# EAGLE design central_sensores (EAGLE 9.2.2)
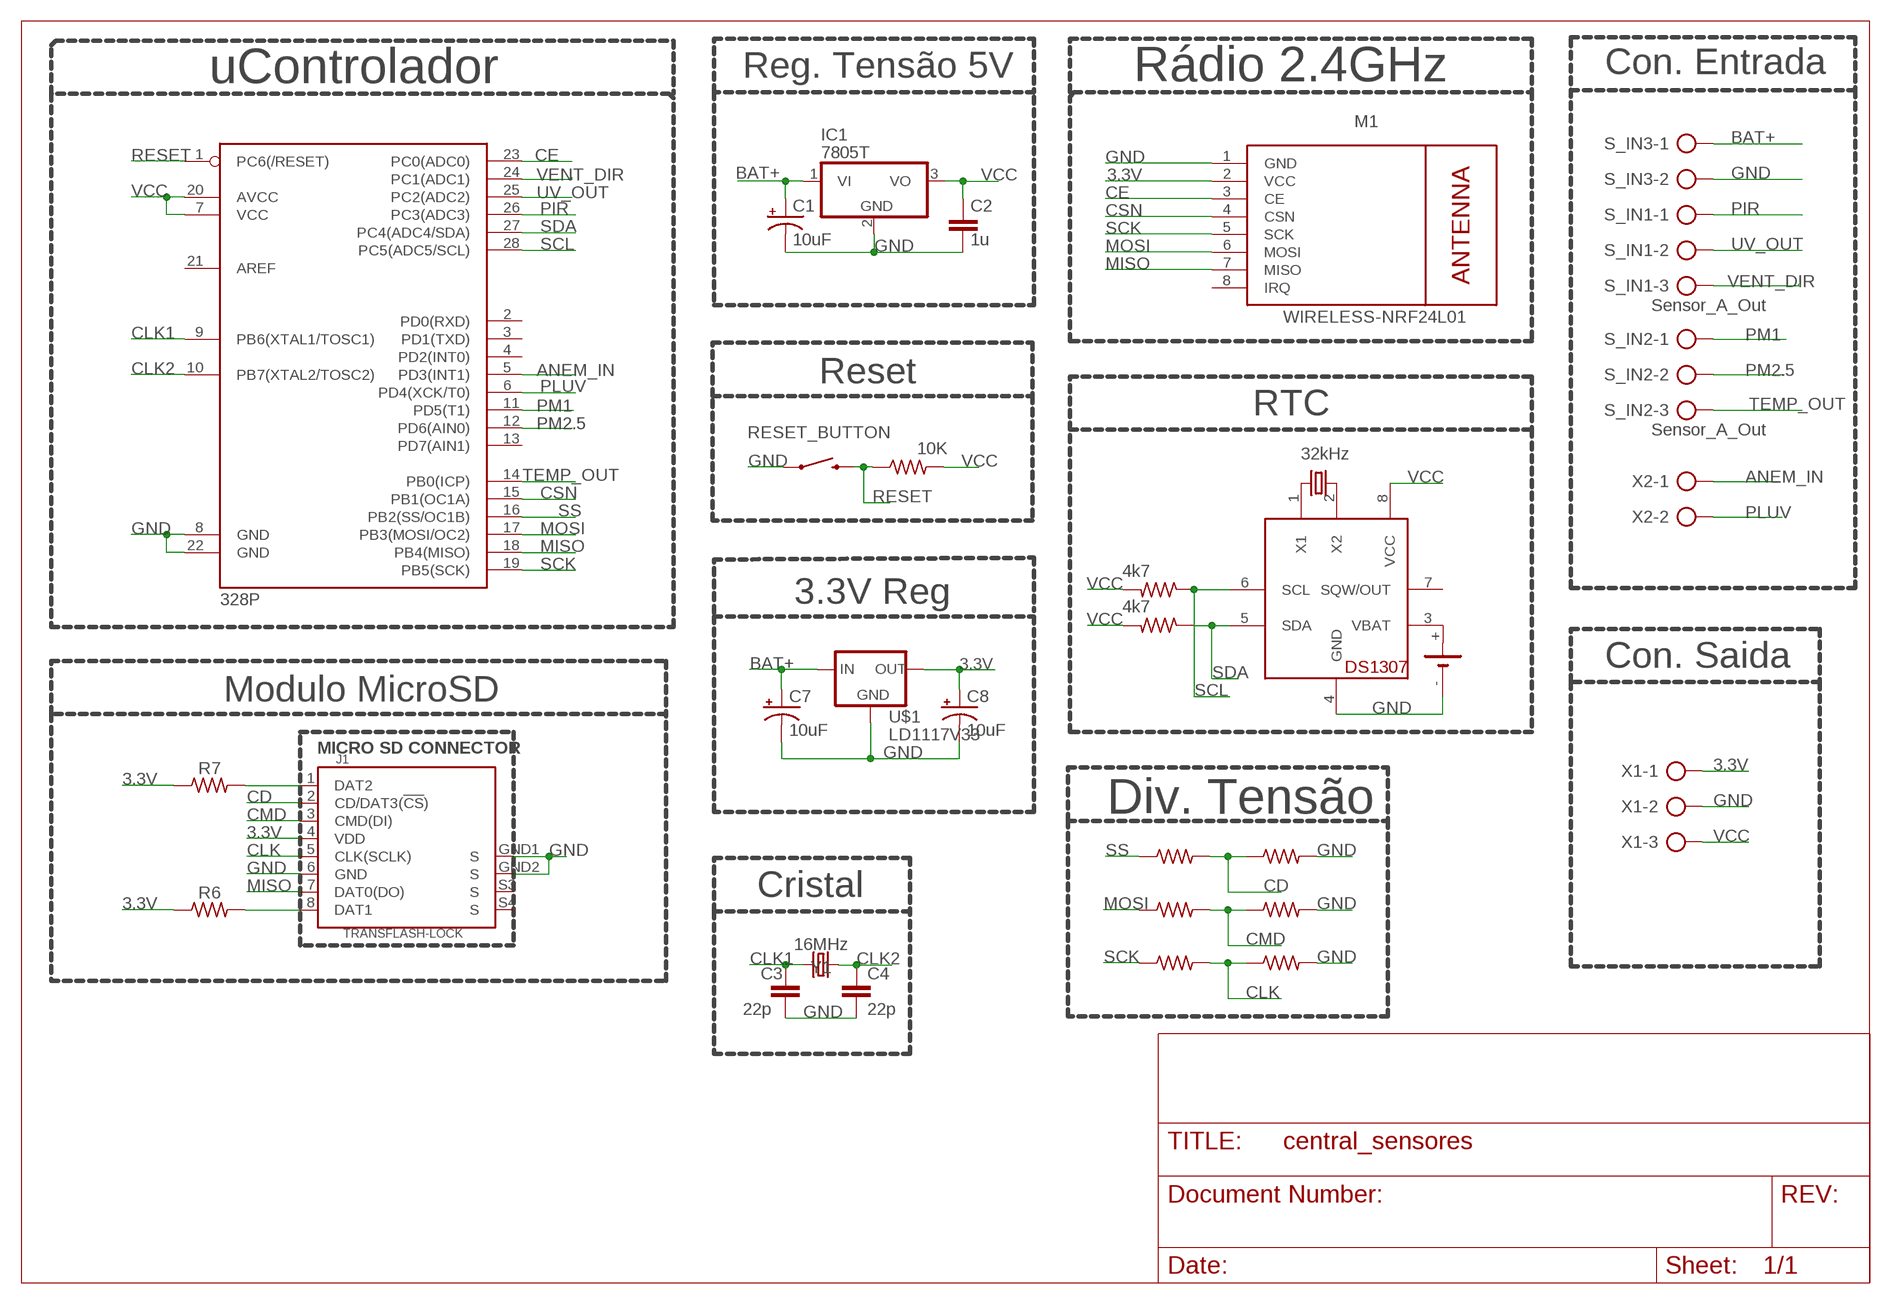
[diagram p0: schematic, sheet 1]

## Parts
C1  10uF  10UF-POLAR-RADIAL-2.5MM-25V-20%  [CPOL-RADIAL-2.5MM-5MM]
C2  1u  C-EU025-024X044  [C025-024X044]
C3  22p  C2,5-3  [C2.5-3]
C4  22p  C2,5-3  [C2.5-3]
C7  10uF  10UF-POLAR-RADIAL-2.5MM-25V-20%  [CPOL-RADIAL-2.5MM-5MM]
C8  10uF  10UF-POLAR-RADIAL-2.5MM-25V-20%  [CPOL-RADIAL-2.5MM-5MM]
G2  CH291-1220LF  [CH291-1220LF]
IC1  7805T  [TO220H]
IC2  DS1307  [DIL08]
J1  TRANSFLASH-LOCK  [TRANSFLASH-LOCK-SOCK]
M1  WIRELESS-NRF24L01  [WIRELESS-NRF24L01]
R1  10K  R-US_0204/7  [0204/7]
R2  R-US_0204/7  [0204/7]
R3  R-US_0204/7  [0204/7]
R4  4k7  R-US_0204/7  [0204/7]
R5  4k7  R-US_0204/7  [0204/7]
R6  100k  R-US_0204/7  [0204/7]
R7  100k  R-US_0204/7  [0204/7]
R8  R-US_0204/7  [0204/7]
R9  R-US_0204/7  [0204/7]
R10  R-US_0204/7  [0204/7]
R11  R-US_0204/7  [0204/7]
RESET_BUTTON  MOMENTARY-SWITCH-SPST-PTH-6.0MM  [TACTILE_SWITCH_PTH_6.0MM]
S_IN1  Sensor_A_Out  AK500/3-H  [AK500/3-H]
S_IN2  Sensor_A_Out  AK500/3-H  [AK500/3-H]
S_IN3  Sensor_A_Out  AK500/2-H  [AK500/2-H]
U1  328P  ATMEGA328P_PDIP  [DIP28]
U$1  LD1117V33  [LD1117V33]
X1  AK500/3-H  [AK500/3-H]
X2  AK500/2-H  [AK500/2-H]
Y1  16MHz  CRYSTAL-16MHZPTH-HC49US  [HC49US]
Y2  32kHz  CRYSTALTC38H  [TC38H]

## Nets
3.3V: C8.1(+) J1.4(VDD) M1.2(VCC) R6.1 R7.1 U$1.OUT X1.1
ANEM_IN: U1.5(PD3(INT1)) X2.1
BAT+: C1.1(+) C7.1(+) IC1.1(VI) S_IN3.1 U$1.IN
CD: J1.2(CD/DAT3(!CS!)) R2.2 R3.1
CE: M1.3(CE) U1.23(PC0(ADC0))
CLK: J1.5(CLK(SCLK)) R10.2 R11.1
CLK1: C3.1 U1.9(PB6(XTAL1/TOSC1)) Y1.2
CLK2: C4.1 U1.10(PB7(XTAL2/TOSC2)) Y1.1
CMD: J1.3(CMD(DI)) R8.2 R9.1
CSN: M1.4(CSN) U1.15(PB1(OC1A))
GND: C1.2(-) C2.2 C3.2 C4.2 C7.2(-) C8.2(-) G2.- IC1.2(GND) IC2.4(GND) J1.6(GND) J1.GND1(S) J1.GND2(S) M1.1(GND) R3.2 R9.2 R11.2 RESET_BUTTON.1 S_IN3.2 U1.8(GND) U1.22(GND) U$1.GND X1.2
MISO: J1.7(DAT0(DO)) M1.7(MISO) U1.18(PB4(MISO))
MOSI: M1.6(MOSI) R8.1 U1.17(PB3(MOSI/OC2))
N$1: IC2.2(X2) Y2.2
N$2: IC2.1(X1) Y2.1
N$3: G2.+ IC2.3(VBAT)
N$4: J1.8(DAT1) R6.2
N$11: J1.1(DAT2) R7.2
PIR: S_IN1.1 U1.26(PC3(ADC3))
PLUV: U1.6(PD4(XCK/T0)) X2.2
PM1: S_IN2.1 U1.11(PD5(T1))
PM2.5: S_IN2.2 U1.12(PD6(AIN0))
RESET: R1.1 RESET_BUTTON.3 U1.1(PC6(/RESET))
SCK: M1.5(SCK) R10.1 U1.19(PB5(SCK))
SCL: IC2.6(SCL) R4.1 U1.28(PC5(ADC5/SCL))
SDA: IC2.5(SDA) R5.1 U1.27(PC4(ADC4/SDA))
SS: R2.1 U1.16(PB2(SS/OC1B))
TEMP_OUT: S_IN2.3 U1.14(PB0(ICP))
UV_OUT: S_IN1.2 U1.25(PC2(ADC2))
VCC: C2.1 IC1.3(VO) IC2.8(VCC) R1.2 R4.2 R5.2 U1.7(VCC) U1.20(AVCC) X1.3
VENT_DIR: S_IN1.3 U1.24(PC1(ADC1))
Unconnected: IC2.7(SQW/OUT) J1.S3(S) J1.S4(S) M1.8(IRQ) U1.2(PD0(RXD)) U1.3(PD1(TXD)) U1.4(PD2(INT0)) U1.13(PD7(AIN1)) U1.21(AREF)

## Notes on the sheet
- uControlador | Reg. Tensão 5V | Rádio 2.4GHz | Con. Entrada
- Reset
- RTC
- 3.3V Reg
- Con. Saida
- Modulo MicroSD
- MICRO SD CONNECTOR
- Div. Tensão
- Cristal

## Library data of the parts
C1 C7 C8 = SparkFun-Capacitors:10UF-POLAR: 10.0µF polarized capacitors A capacitor is a passive two-terminal electrical component used to store electrical energy temporarily in an electric field.; PROD_ID: CAP-08440
C2 = resistor:C-EU: CAPACITOR, European symbol
C3 C4 = capacitor-wima:C: CAPACITOR naming: grid - package width
G2 = battery:CH291-1220LF: Battery Holder, SMT, 12mm multicomp PART NO. CH291-1220LF Source: Data sheet <http://www.farnell.com/datasheets/1505860.pdf>
IC1 = linear:78*: Positive VOLTAGE REGULATOR Source: http://cache.national.com/ds/LM/LM78L05.pdf http://www.fairchildsemi.com/ds/LM/LM7805.pdf
IC2 = adafruit:DS1307: DS1307 Real time clock (RTC) with battery backup ability. Talk to it via i2c
J1 = uSD_socket:TRANSFLASH: TransFlash TF Micro SD Card Socket Adapter
M1 = diy-modules:WIRELESS-NRF24L01: 2.4 GHz Wireless Module based on NRF24L01 chip More details available here: http://www.electrodragon.com/w/NRF24L01 Click here to find device on ebay.com <http://www.ebay.com/sch/nrf24l01+arduino>
R1 R4 R5 = adafruit:R-US_: RESISTOR, American symbol
R2 R3 R6-R11 = resistor:R-US_: RESISTOR, American symbol
RESET_BUTTON = SparkFun-Switches:MOMENTARY-SWITCH-SPST: Momentary Switch (Pushbutton) - SPST Normally-open (NO) SPST momentary switches (buttons, pushbuttons). Variants PTH-12MM - 12mm square, through-hole Momentary Pushbutton Switch - 12mm Square <https://www.sparkfun.com/products/9190> (COM-09190) PTH-6.0MM, PTH-6.0MM-KIT - 6.0mm square, through-hole Mini Pushbutton Switch <https://www.sparkfun.com/products/97> (COM-00097) KIT package intended for soldering kit's - only one side of pads' copper is exposed. PTH-RIGHT-ANGLE-KIT - Right-angle, through-hole Right Angle Tactile Button <https://www.sparkfun.com/products/10791> - Used on SparkFun BigTime Watch Kit <https://www.sparkfun.com/products/11734> SMD-12MM - 12mm square, surface-mount Tactile Button - SMD (12mm) <https://www.sparkfun.com/products/12993> (COM-12993) Used on SparkFun PicoBoard <https://www.sparkfun.com/products/11888> SMD-4.5MM - 4.5mm Square Trackball Switch Used on SparkFun Blackberry Trackballer Breakout <https://www.sparkfun.com/products/13169> SMD-4.6MMX2.8MM - 4.60mm x 2.80mm, surface mount Used on SparkFun SAMD21 Mini Breakout <https://www.sparkfun.com/products/13664> SMD-5.2MM, SMD-5.2-REDUNDANT - 5.2mm square, surface-mount Mini Pushbutton Switch - SMD <https://www.sparkfun.com/products/8720> (COM-08720) Used on Arduino Pro Mini <https://www.sparkfun.com/products/11114> REDUNDANT package connects both switch circuits together SMD-6.0X3.5MM - 6.0 x 3.5mm, surface mount Momentary Reset Switch SMD <https://www.sparkfun.com/products/8229> (COM-08229) SMD-6.2MM-TALL - 6.2mm square, surface mount Tactile Button - SMD (6mm) <https://www.sparkfun.com/products/12992> Used on SparkFun Digital Sandbox <https://www.sparkfun.com/products/12651> SMD-RIGHT-ANGLE - Right-angle, surface mount Used on SparkFun Block for Intel® Edison - Arduino <https://www.sparkfun.com/products/13036>; PROD_ID: SWCH-08441; SF_SKU: COM-00097
S_IN1 S_IN2 X1 = con-ptr500:AK500/3-H: CONNECTOR Aug. 2004 / PTR Meßtechnik: Die Bezeichnung der Serie AK505 wurde geändert. Es handelt sich hierbei um AK500 in horizontaler Ausführung.; OC_FARNELL: unknown; OC_NEWARK: unknown
S_IN3 X2 = con-ptr500:AK500/2-H: CONNECTOR Aug. 2004 / PTR Meßtechnik: Die Bezeichnung der Serie AK505 wurde geändert. Es handelt sich hierbei um AK500 in horizontaler Ausführung.; OC_FARNELL: unknown; OC_NEWARK: unknown
U1 = SparkFun-IC-Microcontroller:ATMEGA328P_PDIP: Atmel 328P Through hole ATMEGA328P uC used in the Arduino 32kb flash, 1k EEPROM, 2k SRAM Datasheet <http://www.sparkfun.com/datasheets/Components/SMD/ATMega328.pdf> SparkFun Products Storefront component: AVR 28 Pin 20MHz 32K 6A/D - ATMega328P <https://www.sparkfun.com/products/9061> (COM-09061) SparkFun Simon Says - Through-Hole Soldering Kit <https://www.sparkfun.com/products/10547> (KIT-10547) SparkFun Learn to Solder - Simon Says <https://www.sparkfun.com/products/13708> (KIT-13708) SparkFun BigTime Watch Kit <https://www.sparkfun.com/products/11734> (KIT-11734) SparkFun ClockIt <https://www.sparkfun.com/products/10930> (KIT-10930) SparkFun Serial Enabled LCD Kit <https://www.sparkfun.com/products/10097> (LCD-10097) SparkFun Simon Tilts - Through Hole Soldering Kit <https://www.sparkfun.com/products/12634> (KIT-12634) SparkFun Frequency Counter Kit <https://www.sparkfun.com/products/10140> (KIT-10140) FabFM Radio Kit <https://www.sparkfun.com/products/11043> (KIT-11043) SparkFun Binary Blaster Kit <https://www.sparkfun.com/products/12037> (KIT-12037) SparkFun Metro-Gnome <https://www.sparkfun.com/products/9236> (KIT-09236) ATmega328 with Arduino Optiboot (Uno) <https://www.sparkfun.com/products/10524> (DEV-10524); PROD_ID: IC-09136
U$1 = LD1117V33:LD1117V33: Quero morrer
Y1 = SparkFun-Clocks:CRYSTAL-16MHZ: 16MHz Crystal Digikey Example <http://www.digikey.com/product-search/en?keywords=535-9122-1-ND> Frequency: 16MHz Frequency Stability: ±50ppm Frequency Tolerance: ±20ppm Load Capacitance: 18pF SparkFun Products: Pro Micro -5V/16MHz <https://www.sparkfun.com/products/12640> SparkFun Serial Enabled LCD Kit <https://www.sparkfun.com/products/10097>; PROD_ID: XTAL-08181; SF_ID: COM-00536
Y2 = SparkFun-FreqCtrl:CRYSTAL: Various standard crystals. Proven footprints.

## Net classes
0 default: width 0.4 mm, drill 0.6 mm, clearance 0.2 mm

## Board
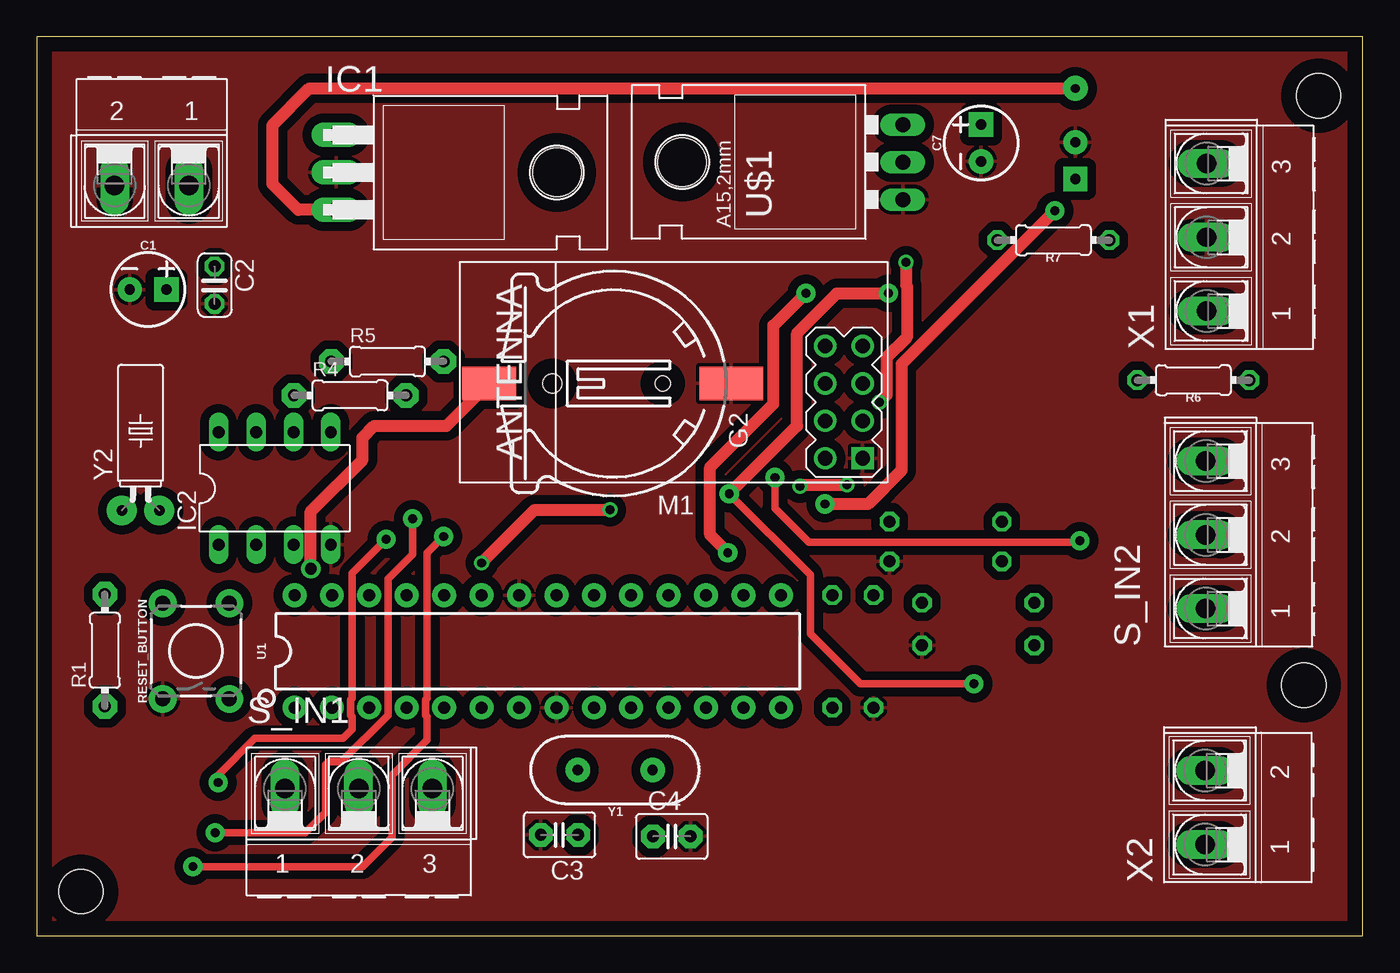
[diagram p1: board, top side]
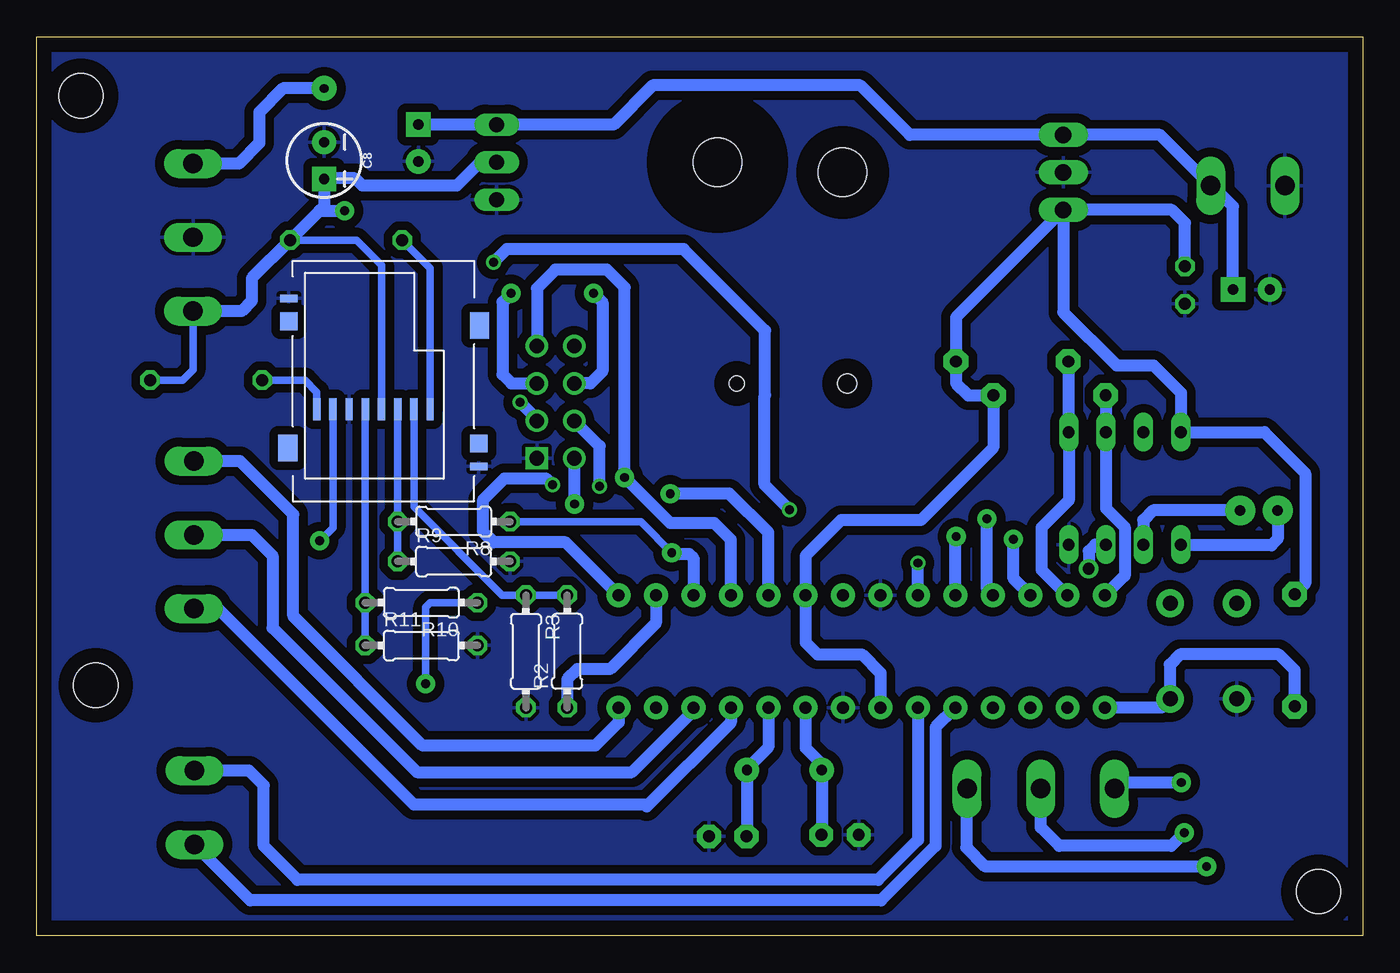
[diagram p2: board, bottom side, seen from below]

Size 90 x 61 mm. Coordinates in mm from the lower left corner, seen from the top.
Outline: 0,0 90,0 90,61 0,61 0,0
Copper layers (1*16): Top 0.035mm / dielectric 1.5mm / Bottom 0.035mm
Design rules "default": minimum track width 6mil, minimum drill 0.35mm, track to track 6mil, track to pad 6mil, pad to pad 6mil, via to via 6mil, smd to smd 6mil, copper to edge 40mil, drill to drill 6mil, minimum pad ring 10mil, minimum via ring 8mil, stop-mask expansion 4mil, vias tented up to drill 0mil, thermal gap 10mil
Holes 3 mm at 3,3 87,57 86,17

### Footprints (pad centres in the part's own frame; a part is rotated, then mirrored left to right if it is on the bottom)
CPOL-RADIAL-2.5MM-5MM = drill 0.7 pad 1.651 square: 1 1.25,0 | drill 0.7 pad 1.651: 2 -1.25,0
C025-024X044 = drill 0.813 octagon: 1 -1.27,0; 2 1.27,0
C2.5-3 = drill 0.813 pad 1.6 octagon: 1 -1.27,0; 2 1.27,0
CH291-1220LF = smd 2.3 x 3.66: + 0,-2.296 | smd 2.3 x 4.3: - 0,14.146 | hole 1.3: 0,2 | hole 1: 0,9.5
TO220H = drill 1.118 long: 1 -2.54,-10.16; 2 0,-10.16; 3 2.54,-10.16 | hole 3.302: 0,4.826
DIL08 = drill 0.813 long: 1 -3.81,-3.81; 2 -1.27,-3.81; 3 1.27,-3.81; 4 3.81,-3.81; 5 3.81,3.81; 6 1.27,3.81; 7 -1.27,3.81; 8 -3.81,3.81
TRANSFLASH-LOCK-SOCK = smd 0.5 x 1.5: 1 3.1,0.74; 2 2,0.74; 3 0.9,0.74; 4 -0.2,0.74; 5 -1.3,0.74; 6 -2.4,0.74; 7 -3.5,0.74; 8 -4.6,0.74 | smd 1.2 x 0.5: GND1 -6.5,8.25; GND2 6.4,-3.15 | smd 1.3 x 1.8: S1 -6.555,-1.9; S3 6.455,6.4 | smd 1.2 x 1.2: S2 -6.495,6.7; S4 6.395,-1.6
WIRELESS-NRF24L01 = drill 1 square: 1 -12.7,6.35 | drill 1: 2 -10.16,6.35; 3 -12.7,3.81; 4 -10.16,3.81; 5 -12.7,1.27; 6 -10.16,1.27; 7 -12.7,-1.27; 8 -10.16,-1.27
0204/7 = drill 0.813 pad 1.676 octagon: 1 -3.81,0; 2 3.81,0
0204/7' = drill 0.813 octagon: 1 -3.81,0; 2 3.81,0
TACTILE_SWITCH_PTH_6.0MM = drill 1.016 pad 1.88: 1 -3.251,2.261; 2 3.251,2.261; 3 -3.251,-2.261; 4 3.251,-2.261
AK500/3-H = drill 1.321 long: 1 -5.004,0; 2 0,0; 3 5.004,0
AK500/2-H = drill 1.321 long: 1 -2.515,0; 2 2.515,0
DIP28 = drill 0.813 pad 1.626: 1 -16.51,-3.81; 2 -13.97,-3.81; 3 -11.43,-3.81; 4 -8.89,-3.81; 5 -6.35,-3.81; 6 -3.81,-3.81; 7 -1.27,-3.81; 8 1.27,-3.81; 9 3.81,-3.81; 10 6.35,-3.81; 11 8.89,-3.81; 12 11.43,-3.81; 13 13.97,-3.81; 14 16.51,-3.81; 15 16.51,3.81; 16 13.97,3.81; 17 11.43,3.81; 18 8.89,3.81; 19 6.35,3.81; 20 3.81,3.81; 21 1.27,3.81; 22 -1.27,3.81; 23 -3.81,3.81; 24 -6.35,3.81; 25 -8.89,3.81; 26 -11.43,3.81; 27 -13.97,3.81; 28 -16.51,3.81
LD1117V33 = drill 1.016 long: GND -2.54,-8.89; IN 2.54,-8.89; OUT 0,-8.89 | hole 3.302: 0,6.096
HC49US = drill 0.7 pad 1.651: 1 -2.54,0; 2 2.54,0
TC38H = drill 0.711 pad 2.032: 1 -1.27,0; 2 1.27,0

### Placement (x,y rotation side)
C1  7.55,43.85 0 top
C2  12.07,44.15 270 top
C3  35.48,6.85 180 top
C4  43.1,6.75 0 top
C7  64.1,53.8 90 top
C8  70.5,52.6 270 bottom
G2  32.99,37.48 270 top
IC1  30.48,51.8 270 top
IC2  16.15,30.36 0 top
J1  66.4,35 0 bottom
M1  43.36,38.75 180 top
R1  4.62,19.37 90 top
R2  [0204/7']  54,19.3 90 bottom
R3  [0204/7']  56.8,19.3 270 bottom
R4  21.26,36.67 0 top
R5  23.8,38.97 0 top
R6  100k  [0204/7']  78.5,37.7 180 top
R7  100k  [0204/7']  69,47.2 180 top
R8  [0204/7']  61.7,28.1 180 bottom
R9  [0204/7']  61.7,25.4 0 bottom
R10  [0204/7']  63.9,22.6 180 bottom
R11  [0204/7']  63.9,19.7 0 bottom
RESET_BUTTON  10.81,19.32 90 top
S_IN1  21.85,9.98 0 top
S_IN2  79.35,27.21 90 top
S_IN3  7.8,50.9 180 top
U1  34,19.3 0 top
U$1  49.9,52.5 90 top
X1  79.4,47.4 90 top
X2  79.3,8.7 90 top
Y1  39.26,11.25 180 top
Y2  7.04,28.86 0 top

### Tracks (layer width: path | path; a pad name or v marks a point on that pad's centre or on a via)
3.3V  (via drill 0.6 pad 1.3)
  Top 0.813: v69.1,49.2 58.7,38.8 58.7,31.6 56.4,29.3 v53.5,29.3
  Bottom 0.508: R7.1 68.3,47.2 66.6,45.5 J1.4 | R6.1 80.1,37.7 79.4,38.4 X1.1
  Bottom 0.813: 70.81,49.2 R7.1 75.4,44.61 75.4,43.1 76.1,42.4 X1.1 | 70.81,49.2 v69.1,49.2 | v53.5,29.3 53.5,32.38 M1.2 | U$1.OUT 59.9,52.5 61.5,50.9 67.9,50.9 68.4,51.4 70.45,51.4 C8.1 70.5,49.51 70.81,49.2
ANEM_IN
  Bottom 0.813: U1.5 29,14.14 29,6.1 32.7,2.4 75.52,2.4 X2.1
BAT+
  Bottom 0.813: C1.1 8.8,49.5 10.2,50.9 S_IN3.1 13.76,54.34 IC1.1 30.74,54.34 34.1,57.7 48.2,57.7 50.86,55.04 U$1.IN C7.1
CD
  Bottom 0.508: R2.2 R3.1 58.41,23.11 64.4,29.1 J1.2
CE  (via drill 0.6)
  Top 0.813: v30.2,25.3 33.8,28.9 v38.9,28.9 | v59,45.7 59,44.18 59.06,44.12 59.06,40.59 57.69,39.22 57.69,36.69 v57.2,36.2
  Bottom 0.813: U1.23 v30.19,25.29 v30.2,25.3 | v38.9,28.9 40.6,30.6 40.6,36.65 40.57,36.68 40.57,41.07 46.1,46.6 58.1,46.6 v59,45.7 | v57.2,36.2 56.06,35.06 M1.3
CLK
  Bottom 0.508: R11.1 R10.2 J1.5
CLK1
  Bottom 0.813: C3.1 36.72,6.88 Y1.2 36.72,11.65 37.82,12.75 37.81,12.76 U1.9
CLK2
  Bottom 0.813: C4.1 41.8,6.78 Y1.1 41.8,11.35 40.35,12.8 U1.10
CMD
  Bottom 0.508: R9.1 R8.2 J1.3
CSN  (via drill 0.6)
  Top 0.813: v55,30.6 54.96,30.56 51.86,30.56 v51.8,30.5
  Bottom 0.813: U1.15 54.1,26.7 59,26.7 59.7,27.4 59.7,29.6 58.26,31.04 55.44,31.04 v55,30.6 | v51.8,30.5 51.8,33.22 M1.4
GND
  pour Top (isolate 0.6): 0,0 90,0 90,61 0,61
  pour Bottom (isolate 0.6): 0,0 90,0 90,61 0,61
MISO  (via drill 0.6 pad 1.3)
  Top 0.508: v50.1,31.1 50.1,29 52.4,26.7 70.7,26.7 v70.8,26.8
  Bottom 0.508: J1.7 69.9,27.7 v70.8,26.8
  Bottom 0.813: M1.7 56.06,43.94 54.8,45.2 51.3,45.2 50.1,44 v50.1,31.1 47,28 44,28 42.9,26.9 U1.18
MOSI  (via drill 0.6 pad 1.3)
  Top 0.813: v46.9,26 45.7,27.2 45.7,31.8 50,36.1 50,41.4 v52.2,43.6
  Bottom 0.508: R8.1 49,28.1 46.8,25.9
  Bottom 0.813: v46.9,26 46.8,25.9 45.7,25.9 45.44,25.64 U1.17 | v52.2,43.6 51.6,43 51.6,38.3 52.42,37.48 M1.6
N$1
  Bottom 0.813: Y2.2 14.24,28.86 14.9,28.2 14.88,28.18 IC2.2
N$2
  Bottom 0.813: Y2.1 5.77,26.93 6.2,26.5 12.29,26.5 IC2.1
N$3  (via drill 0.8 pad 1.3)
  Top 0.813: v18.6,24.9 18.6,28.8 22.1,32.3 22.1,33.8 22.9,34.6 27.81,34.6 G2.+
  Bottom 0.813: IC2.3 18.15,26.55 18.6,26.1 v18.6,24.9
N$4
  Bottom 0.508: J1.8 71,36.9 71.8,37.7 R6.2
N$11
  Bottom 0.508: R7.2 63.3,45.31 J1.1
PIR  (via drill 0.6 pad 1.3)
  Top 0.508: v23.7,26.9 21.4,24.6 21.4,16.11 21.3,16.02 21.3,14.96 21.4,14.87 21.4,14 20.8,13.4 14.8,13.4 12.3,10.9 v12.3,10.4
  Bottom 0.813: U1.26 23.7,24.24 v23.7,26.9 | v12.3,10.4 16.43,10.4 S_IN1.1
PLUV
  Bottom 0.813: U1.6 30.19,6.51 32.9,3.8 72.3,3.8 74.6,6.1 74.6,10.2 75.6,11.2 79.28,11.2 X2.2
PM1
  Bottom 0.813: U1.11 42.89,14.49 48.6,8.78 48.6,8.9 64.4,8.9 77.6,22.1 79.24,22.1 S_IN2.1
PM2.5
  Bottom 0.813: S_IN2.2 75.41,27.21 74,25.8 74,20.9 64.2,11.1 49.6,11.1 45.43,15.27 U1.12
RESET
  Bottom 0.813: R1.1 4.62,18.02 5.7,19.1 12.4,19.1 13.1,18.4 13.1,16.1 RESET_BUTTON.3 13.65,15.49 U1.1
SCK  (via drill 0.6 pad 1.3)
  Top 0.508: v47,30 52.5,24.5 52.5,20.5 55.9,17.1 v63.6,17.1
  Top 0.813: v47,30 51.6,34.6 51.6,40.9 54.3,43.6 v57.8,43.6
  Bottom 0.508: v63.6,17.1 63.6,22.3 63.3,22.6 R10.1
  Bottom 0.813: v47,30 43,30 40.35,27.35 U1.19 | v57.8,43.6 58.4,43 58.4,38.1 57.78,37.48 M1.5
SCL
  Bottom 0.813: R4.1 17.45,34.2 IC2.6 17.42,29 16.15,27.73 16.15,24.42 16.18,24.42 U1.28
SDA
  Bottom 0.813: R5.1 19.99,34.2 IC2.5 19.96,29.54 21.8,27.7 21.8,24.83 20.08,23.11 U1.27
SS
  Bottom 0.813: U1.16 47.97,21.23 51.1,18.1 53.3,18.1 54,17.4 R2.1
TEMP_OUT
  Bottom 0.813: U1.14 50.51,14.49 52.1,12.9 63.8,12.9 72.6,21.7 72.6,28.6 76.21,32.21 S_IN2.3
UV_OUT  (via drill 0.6 pad 1.3)
  Top 0.508: v25.5,28.3 25.5,25.9 23.84,24.24 23.84,14.97 20.67,11.8 19.8,11.8 19.6,11.6 19.6,8.4 18.2,7 v12.1,7
  Bottom 0.813: U1.25 25.5,23.5 v25.5,28.3 | v12.1,7 13,6.1 20.6,6.1 21.85,7.35 S_IN1.2
VCC  (via drill 0.6 pad 1.7)
  Top 0.813: IC1.3 17.74,49.26 16,51 16,55 18.5,57.5 v70.5,57.5
  Bottom 0.813: C2.1 12.07,48.37 12.96,49.26 IC1.3 | IC1.3 27.61,41.97 R5.2 27.61,37.51 26.77,36.67 R4.2 25.07,33.13 30,28.2 35.4,28.2 37.82,25.78 U1.20 37.81,19.91 37,19.1 34,19.1 32.73,17.83 U1.7 | IC1.3 20.32,42.32 16.7,38.7 14.2,38.7 12.34,36.84 IC2.8 6.67,34.17 3.9,31.4 3.9,23.9 R1.2 | v70.5,57.5 73.3,57.5 74.9,55.9 74.9,53.8 76.3,52.4 X1.3
VENT_DIR  (via drill 0.6 pad 1.3)
  Top 0.508: v27.6,27.1 26.5,26 26.5,16.13 26.38,16.02 26.38,14.96 26.5,14.85 26.5,13.3 24.1,10.9 24.1,6.7 22.1,4.7 v10.6,4.7
  Bottom 0.813: U1.24 27.65,27.05 v27.6,27.1 | v10.6,4.7 25.6,4.7 26.9,6 26.85,6.05 S_IN1.3